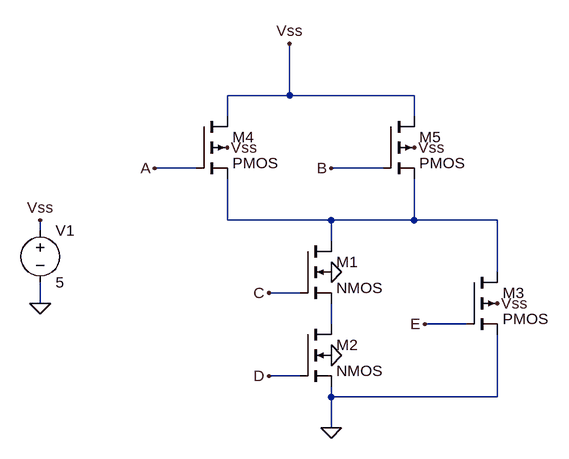
[diagram p0: schematic Draft1.asc]
Draft1.asc, the LTspice schematic file:
Version 4
SHEET 1 944 680
WIRE 448 -64 448 -144
WIRE 448 -64 352 -64
WIRE 640 -64 448 -64
WIRE 352 -32 352 -64
WIRE 640 -32 640 -64
WIRE 304 48 240 48
WIRE 592 48 512 48
WIRE 352 128 352 64
WIRE 512 128 352 128
WIRE 640 128 640 64
WIRE 640 128 512 128
WIRE 768 128 640 128
WIRE 64 144 64 128
WIRE 512 160 512 128
WIRE 768 208 768 128
WIRE 464 240 416 240
WIRE 64 256 64 224
WIRE 512 288 512 256
WIRE 720 288 656 288
WIRE 464 368 416 368
WIRE 512 400 512 384
WIRE 768 400 768 304
WIRE 768 400 512 400
WIRE 512 448 512 400
FLAG 64 256 0
FLAG 64 128 Vss
FLAG 512 208 0
FLAG 512 336 0
FLAG 512 448 0
FLAG 768 256 Vss
FLAG 448 -144 Vss
FLAG 352 16 Vss
FLAG 640 16 Vss
FLAG 416 240 C
FLAG 416 368 D
FLAG 656 288 E
FLAG 512 48 B
FLAG 240 48 A
SYMBOL voltage 64 128 R0
WINDOW 123 0 0 Left 0
WINDOW 39 0 0 Left 0
SYMATTR InstName V1
SYMATTR Value 5
SYMBOL nmos4 464 160 R0
SYMATTR InstName M1
SYMBOL nmos4 464 288 R0
SYMATTR InstName M2
SYMBOL pmos4 720 208 R0
SYMATTR InstName M3
SYMBOL pmos4 304 -32 R0
SYMATTR InstName M4
SYMBOL pmos4 592 -32 R0
SYMATTR InstName M5

The netlist it stands for:
* Draft1.asc
V1 Vss 0 5
M1 N001 C N002 0 NMOS
M2 N002 D 0 0 NMOS
M3 N001 E 0 Vss PMOS
M4 Vss A N001 Vss PMOS
M5 Vss B N001 Vss PMOS
.model NMOS NMOS
.model PMOS PMOS
.lib standard.mos
.backanno
.end